# EAGLE schematic controller (EAGLE 9.1.0)
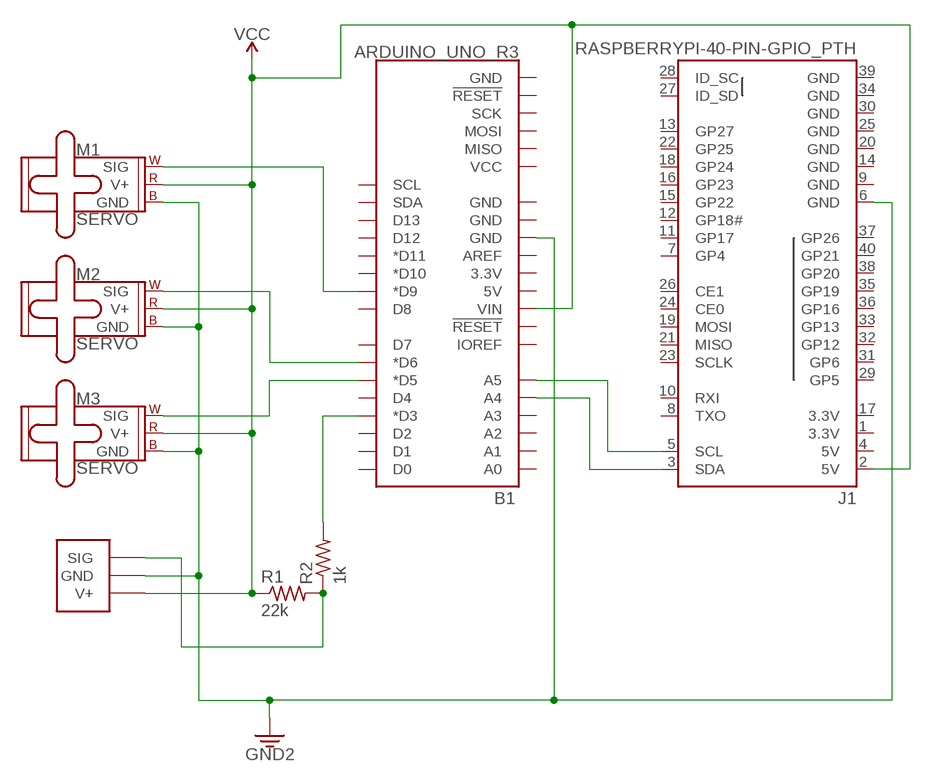
[diagram p0: schematic, sheet 1]

## Parts
B1  ARDUINO_UNO_R3  [ARDUINO_R3]
J1  RASPBERRYPI-40-PIN-GPIO_PTH  [2X20_SHROUDED]
L1  MECCANO_LED  (no package)
M1  SERVO  [1X03]
M2  SERVO  [1X03]
M3  SERVO  [1X03]
R1  22k  R-US_0204/7  [0204/7]
R2  1k  R-US_0204/7  [0204/7]
U$1  MECCANO_LED  (no package)  (not placed on a sheet)

## Nets
3.3V: B1.GND@4(GND) J1.6(GND) L1.GND M1.3(GND) M2.3(GND) M3.3(GND) ; supply symbol labelled GND2
N$1: B1.MISO J1.34(GND)
N$2: B1.A4 J1.3(SDA)
N$3: B1.A5 J1.5(SCL)
N$4: L1.SIG R1.2 R2.1
N$5: B1.D3(*D3) R2.2
N$6: B1.D5(*D5) M3.1(SIG)
N$7: B1.D6(*D6) M2.1(SIG)
N$8: B1.D9(*D9) M1.1(SIG)
VCC: B1.VIN J1.2(5V) L1.V+ M1.2(V+) M2.2(V+) M3.2(V+) R1.1
Unconnected: B1.3.3V B1.5V B1.A0 B1.A1 B1.A2 B1.A3 B1.AREF B1.D0 B1.D1 B1.D2 B1.D4 B1.D7 B1.D8 B1.D10(*D10) B1.D11(*D11) B1.D12 B1.D13 B1.GND@1(GND) B1.GND@2(GND) B1.GND@3(GND) B1.IOREF B1.MOSI B1.RESET@1(!RESET!) B1.RESET@2(!RESET!) B1.SCK B1.SCL B1.SDA B1.VCC J1.7(GP4) J1.8(TXO) J1.10(RXI) J1.11(GP17) J1.12(GP18#) J1.13(GP27) J1.15(GP22) J1.16(GP23) J1.18(GP24) J1.19(MOSI) J1.21(MISO) J1.22(GP25) J1.23(SCLK) J1.24(CE0) J1.26(CE1) J1.27(ID_SD) J1.28(ID_SC) J1.29(GP5) J1.31(GP6) J1.32(GP12) J1.33(GP13) J1.35(GP19) J1.36(GP16) J1.37(GP26) J1.38(GP20) J1.40(GP21) U$1.GND U$1.SIG U$1.V+

## Power pins joined to a net without a drawn wire
3.3V: J1.1(3.3V) J1.17(3.3V)
5V: J1.4(5V)
GND: J1.9(GND) J1.14(GND) J1.20(GND) J1.25(GND) J1.30(GND) J1.39(GND)

## Library data of the parts
B1 = SparkFun-Boards:ARDUINO_UNO_R3: Arduino R3 Footprint with SPI header Arduino Uno R3 Compatible Footprint. Matches PCB size of the original board. SparkFun Products: SAMD21 Dev Breakout <https://www.sparkfun.com/products/13672> RedBoard <https://www.sparkfun.com/products/12757> R3 Stackable Headers <https://www.sparkfun.com/products/11417>
J1 = SparkFun-Connectors:RASPBERRYPI-40-PIN-GPIO: Raspberry Pi GPIO Header 2x20 pin connector, as found on B, B+, A+ models. Both shrouded PTH and SMT versions available. SparkFun Products: GPIO Shrouded Header <https://www.sparkfun.com/products/13054>- PTH SparkFun Pi Wedge (Preassembled) <https://www.sparkfun.com/products/13717>; PROD_ID: CONN-12263; SF_ID: PRT-13054
L1 U$1 = user:MECCANO_LED: Meccano RGB LED
M1-M3 = SparkFun-Electromechanical:SERVO: Servo Motor 3-pin connector for a standard servo motor (voltage supply, ground, and control signal.) SparkFun Products Servo - Generic (Sub-Micro Size) <https://www.sparkfun.com/products/9065> (ROB-09065) Servo - Generic High Torque Continuous Rotation (Standard Size) <https://www.sparkfun.com/products/9347> (ROB-09347) Servo - Generic High Torque (Standard Size) <https://www.sparkfun.com/products/11965> (ROB-11965)
R1 R2 = rcl:R-US_: RESISTOR, American symbol; SPICEPREFIX: R